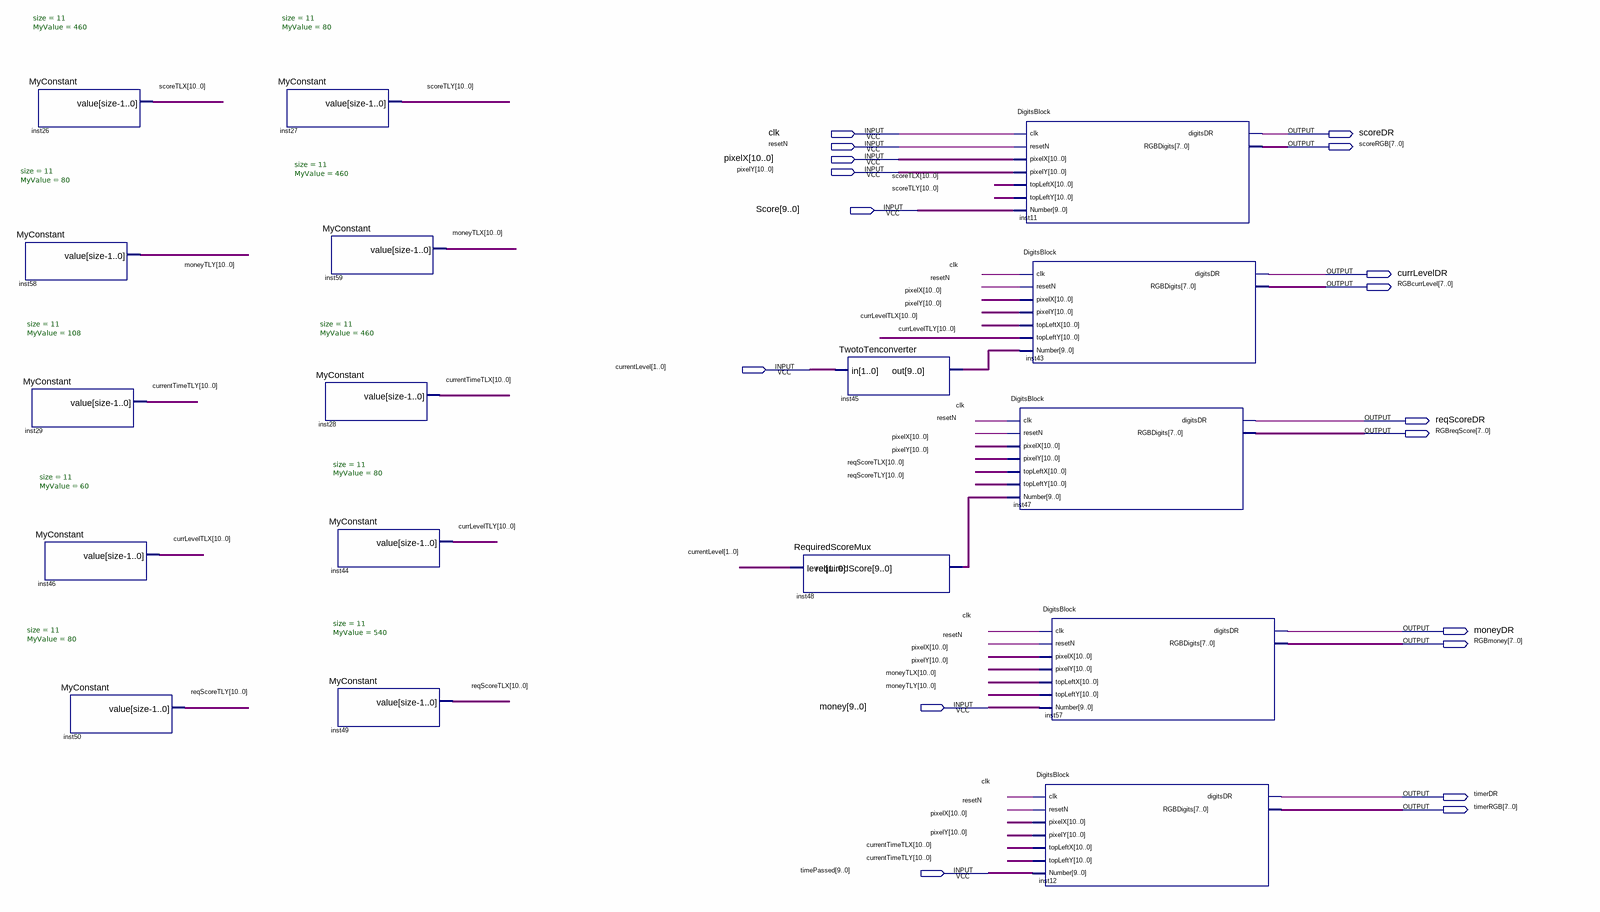
[diagram p0: schematic sheet]
// Quartus schematic Digits_Top.bdf as structural Verilog: 17 symbols, 18 pins
module Digits_Top (
  input  clk,
  input  resetN,
  input  [10:0] pixelX,
  input  [10:0] pixelY,
  input  [9:0] Score,
  input  [1:0] currentLevel,
  input  [9:0] money,
  input  [9:0] timePassed,
  output scoreDR,
  output [7:0] scoreRGB,
  output currLevelDR,
  output [7:0] RGBcurrLevel,
  output reqScoreDR,
  output [7:0] RGBreqScore,
  output moneyDR,
  output [7:0] RGBmoney,
  output timerDR,
  output [7:0] timerRGB
);

  wire [9:0] inst45_out, inst48_requiredscore;
  wire [10:0] currentTimeTLX, currentTimeTLY, currLevelTLX, currLevelTLY, moneyTLX, moneyTLY, reqScoreTLX,
       reqScoreTLY, scoreTLX, scoreTLY;

  MyConstant #(.size(11), .MyValue(80)) inst58 (.value(moneyTLY));
  MyConstant #(.size(11), .MyValue(460)) inst26 (.value(scoreTLX));
  MyConstant #(.size(11), .MyValue(108)) inst29 (.value(currentTimeTLY));
  MyConstant #(.size(11), .MyValue(60)) inst46 (.value(currLevelTLX));
  MyConstant #(.size(11), .MyValue(80)) inst50 (.value(reqScoreTLY));
  MyConstant #(.size(11), .MyValue(80)) inst27 (.value(scoreTLY));
  MyConstant #(.size(11), .MyValue(460)) inst59 (.value(moneyTLX));
  MyConstant #(.size(11), .MyValue(460)) inst28 (.value(currentTimeTLX));
  MyConstant #(.size(11), .MyValue(80)) inst44 (.value(currLevelTLY));
  MyConstant #(.size(11), .MyValue(540)) inst49 (.value(reqScoreTLX));
  RequiredScoreMux inst48 (.level(currentLevel), .requiredScore(inst48_requiredscore));
  TwotoTenconverter inst45 (.in(currentLevel), .out(inst45_out));
  DigitsBlock inst11 (
    .clk(clk), .resetN(resetN), .pixelX(pixelX), .pixelY(pixelY), .topLeftX(scoreTLX), .topLeftY(scoreTLY),
    .Number(Score), .digitsDR(scoreDR), .RGBDigits(scoreRGB));
  DigitsBlock inst43 (
    .clk(clk), .resetN(resetN), .pixelX(pixelX), .pixelY(pixelY), .topLeftX(currLevelTLX),
    .topLeftY(currLevelTLY), .Number(inst45_out), .digitsDR(currLevelDR), .RGBDigits(RGBcurrLevel));
  DigitsBlock inst47 (
    .clk(clk), .resetN(resetN), .pixelX(pixelX), .pixelY(pixelY), .topLeftX(reqScoreTLX),
    .topLeftY(reqScoreTLY), .Number(inst48_requiredscore), .digitsDR(reqScoreDR), .RGBDigits(RGBreqScore));
  DigitsBlock inst12 (
    .clk(clk), .resetN(resetN), .pixelX(pixelX), .pixelY(pixelY), .topLeftX(currentTimeTLX),
    .topLeftY(currentTimeTLY), .Number(timePassed), .digitsDR(timerDR), .RGBDigits(timerRGB));
  DigitsBlock inst57 (
    .clk(clk), .resetN(resetN), .pixelX(pixelX), .pixelY(pixelY), .topLeftX(moneyTLX), .topLeftY(moneyTLY),
    .Number(money), .digitsDR(moneyDR), .RGBDigits(RGBmoney));
endmodule
